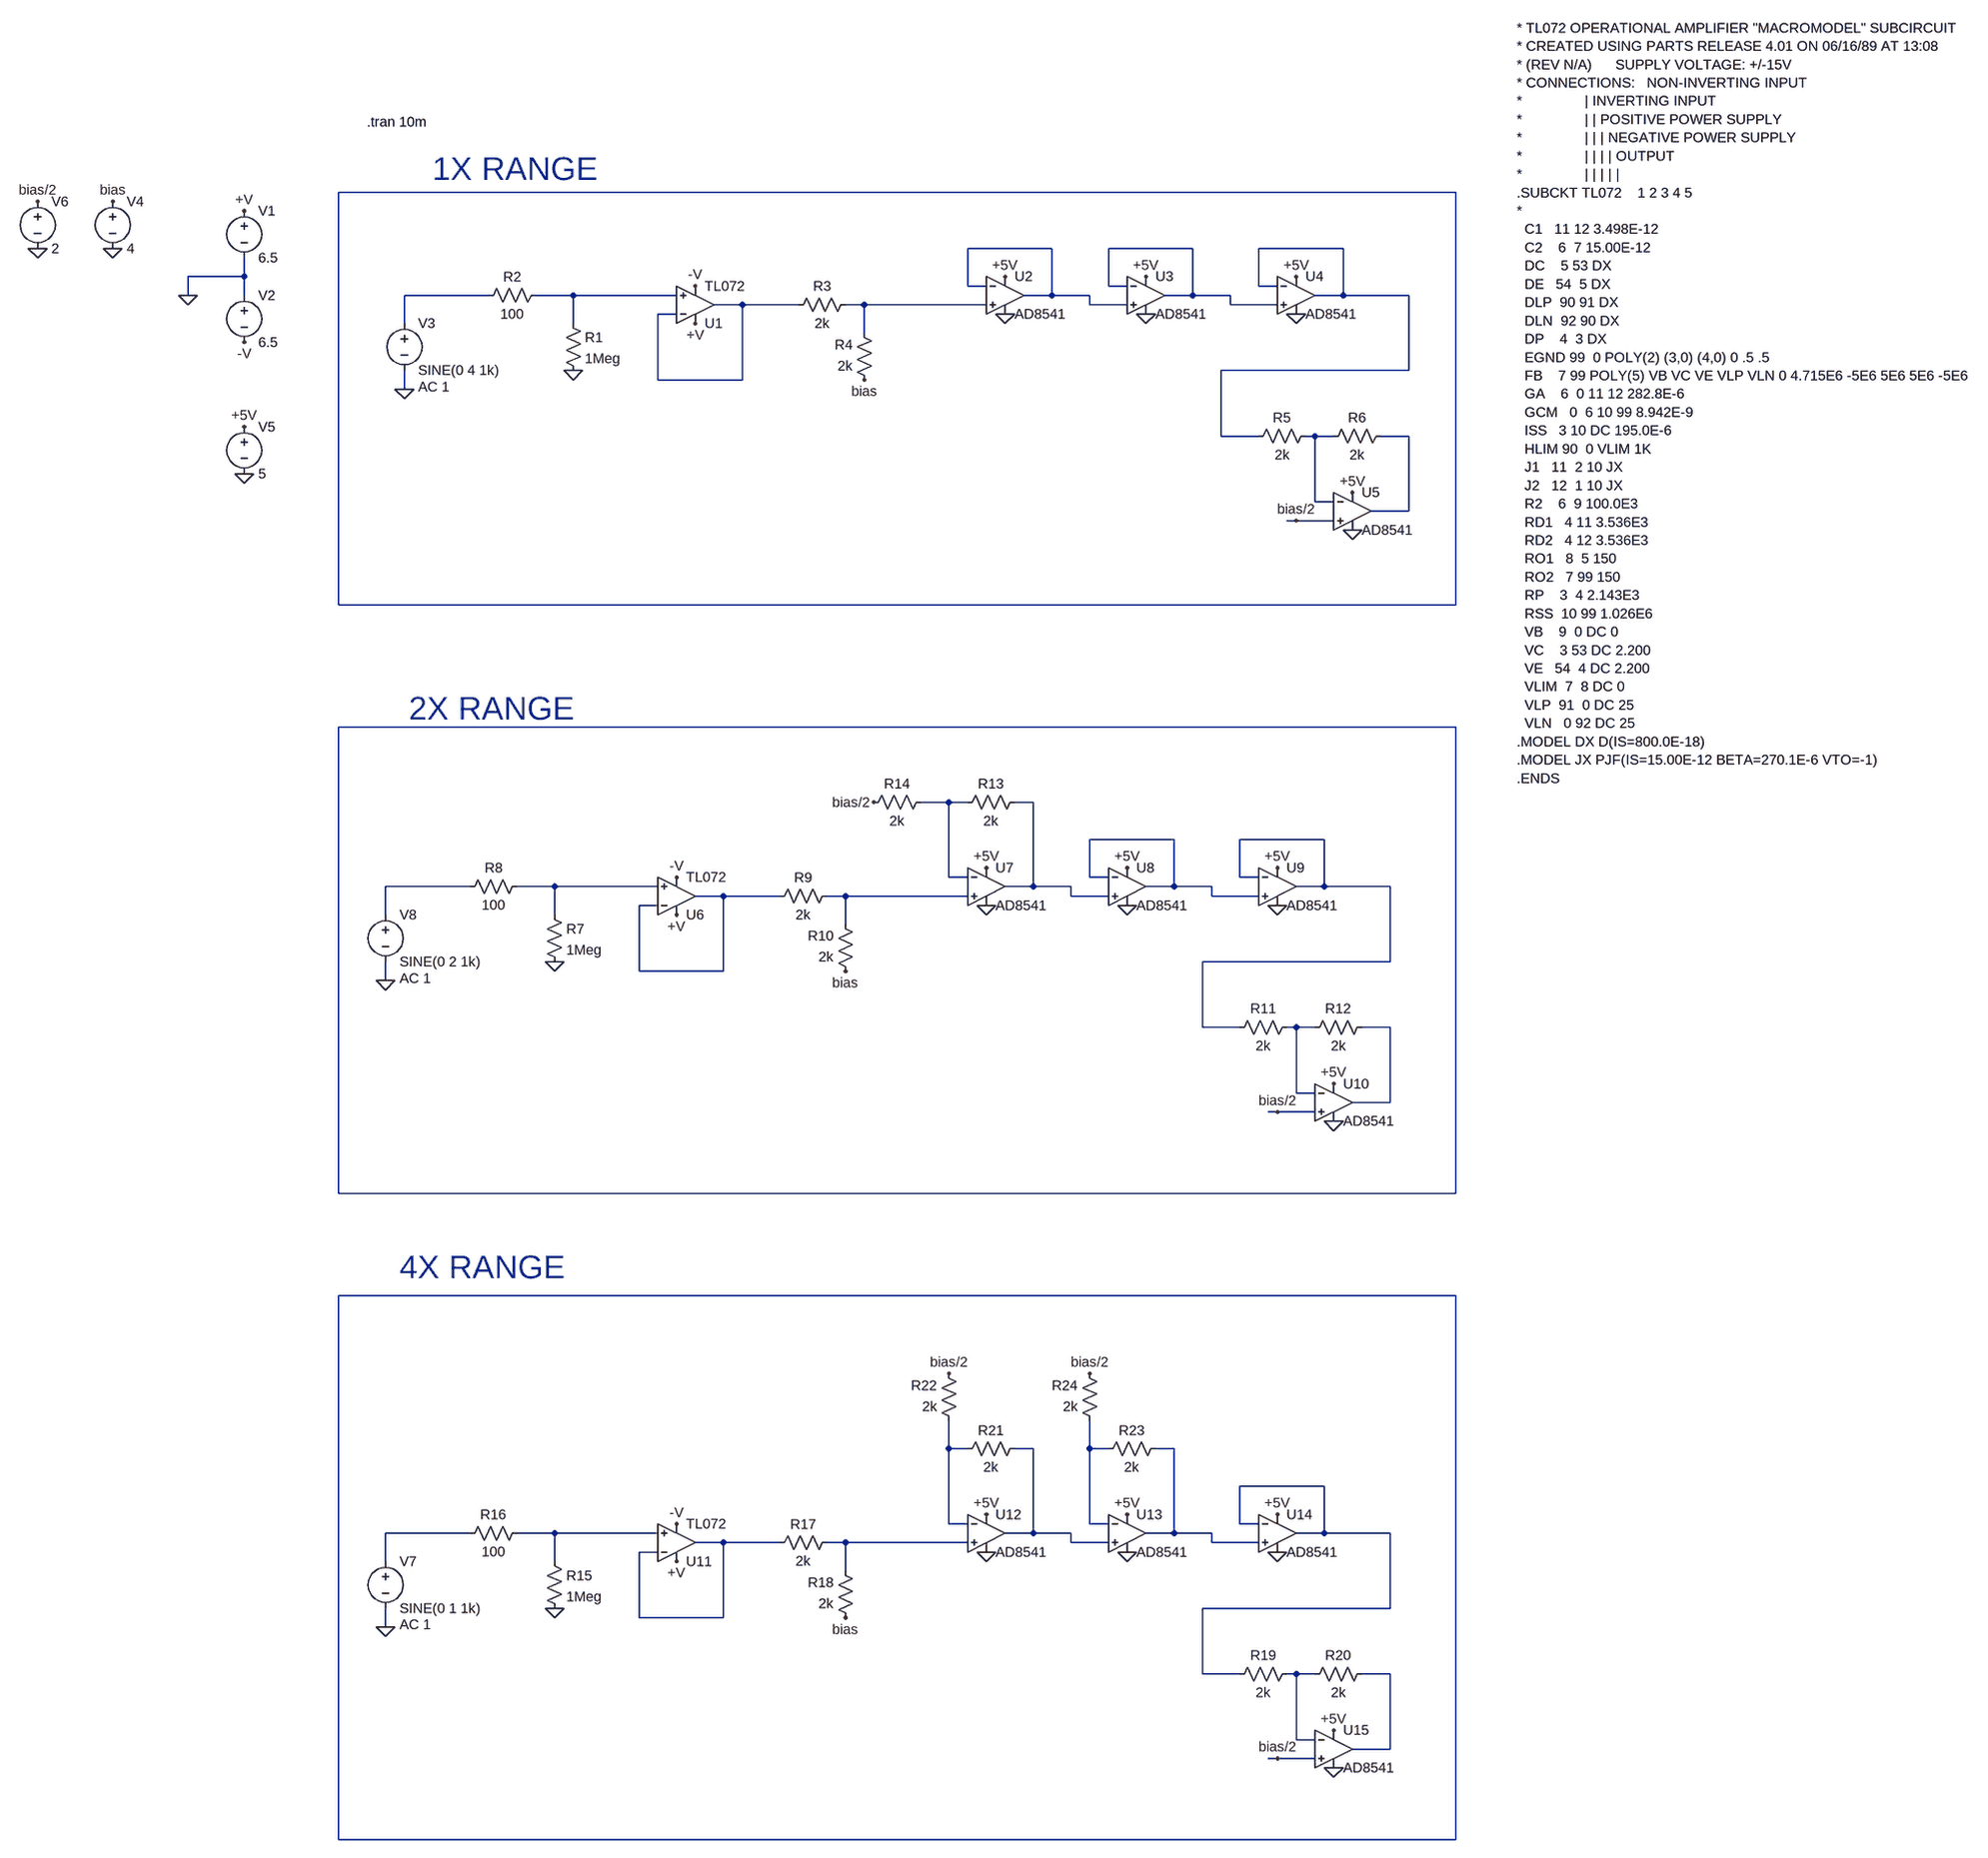
[diagram p0: schematic Analog_inputs.asc]
Analog_inputs.asc, the LTspice schematic file:
Version 4
SHEET 1 3056 3076
WIRE 1680 80 -224 80
WIRE 992 176 848 176
WIRE 1232 176 1088 176
WIRE 1488 176 1344 176
WIRE -480 224 -480 192
WIRE -480 224 -576 224
WIRE 848 240 848 176
WIRE 880 240 848 240
WIRE 1088 240 1088 176
WIRE 1120 240 1088 240
WIRE 1344 240 1344 176
WIRE 1376 240 1344 240
WIRE -576 256 -576 224
WIRE -480 256 -480 224
WIRE 32 256 -112 256
WIRE 176 256 112 256
WIRE 352 256 176 256
WIRE 992 256 992 176
WIRE 992 256 944 256
WIRE 1056 256 992 256
WIRE 1232 256 1232 176
WIRE 1232 256 1184 256
WIRE 1296 256 1232 256
WIRE 1488 256 1488 176
WIRE 1488 256 1440 256
WIRE 1600 256 1488 256
WIRE 464 272 416 272
WIRE 560 272 464 272
WIRE 672 272 640 272
WIRE 880 272 672 272
WIRE 1056 272 1056 256
WIRE 1120 272 1056 272
WIRE 1296 272 1296 256
WIRE 1376 272 1296 272
WIRE 352 288 320 288
WIRE -112 304 -112 256
WIRE 176 304 176 256
WIRE 672 320 672 272
WIRE 1600 384 1600 256
WIRE 1600 384 1280 384
WIRE 320 400 320 288
WIRE 464 400 464 272
WIRE 464 400 320 400
WIRE -112 416 -112 384
WIRE 1280 496 1280 384
WIRE 1344 496 1280 496
WIRE 1440 496 1424 496
WIRE 1472 496 1440 496
WIRE 1600 496 1552 496
WIRE 1440 608 1440 496
WIRE 1472 608 1440 608
WIRE 1600 624 1600 496
WIRE 1600 624 1536 624
WIRE 1408 640 1392 640
WIRE 1472 640 1408 640
WIRE -224 784 -224 80
WIRE 1680 784 1680 80
WIRE 1680 784 -224 784
WIRE 1680 992 -224 992
WIRE 816 1120 768 1120
WIRE 848 1120 816 1120
WIRE 960 1120 928 1120
WIRE 1200 1184 1056 1184
WIRE 1456 1184 1312 1184
WIRE 816 1248 816 1120
WIRE 848 1248 816 1248
WIRE 1056 1248 1056 1184
WIRE 1088 1248 1056 1248
WIRE 1312 1248 1312 1184
WIRE 1344 1248 1312 1248
WIRE 0 1264 -144 1264
WIRE 144 1264 80 1264
WIRE 320 1264 144 1264
WIRE 960 1264 960 1120
WIRE 960 1264 912 1264
WIRE 1024 1264 960 1264
WIRE 1200 1264 1200 1184
WIRE 1200 1264 1152 1264
WIRE 1264 1264 1200 1264
WIRE 1456 1264 1456 1184
WIRE 1456 1264 1408 1264
WIRE 1568 1264 1456 1264
WIRE 432 1280 384 1280
WIRE 528 1280 432 1280
WIRE 640 1280 608 1280
WIRE 848 1280 640 1280
WIRE 1024 1280 1024 1264
WIRE 1088 1280 1024 1280
WIRE 1264 1280 1264 1264
WIRE 1344 1280 1264 1280
WIRE 320 1296 288 1296
WIRE -144 1312 -144 1264
WIRE 144 1312 144 1264
WIRE 640 1328 640 1280
WIRE 1568 1392 1568 1264
WIRE 1568 1392 1248 1392
WIRE 288 1408 288 1296
WIRE 432 1408 432 1280
WIRE 432 1408 288 1408
WIRE -144 1424 -144 1392
WIRE 1248 1504 1248 1392
WIRE 1312 1504 1248 1504
WIRE 1408 1504 1392 1504
WIRE 1440 1504 1408 1504
WIRE 1568 1504 1520 1504
WIRE 1408 1616 1408 1504
WIRE 1440 1616 1408 1616
WIRE 1568 1632 1568 1504
WIRE 1568 1632 1504 1632
WIRE 1376 1648 1360 1648
WIRE 1440 1648 1376 1648
WIRE -224 1792 -224 992
WIRE 1680 1792 1680 992
WIRE 1680 1792 -224 1792
WIRE 1680 2096 -224 2096
WIRE 816 2384 816 2336
WIRE 848 2384 816 2384
WIRE 960 2384 928 2384
WIRE 1056 2384 1056 2336
WIRE 1088 2384 1056 2384
WIRE 1200 2384 1168 2384
WIRE 1456 2448 1312 2448
WIRE 816 2512 816 2384
WIRE 848 2512 816 2512
WIRE 1056 2512 1056 2384
WIRE 1088 2512 1056 2512
WIRE 1312 2512 1312 2448
WIRE 1344 2512 1312 2512
WIRE 0 2528 -144 2528
WIRE 144 2528 80 2528
WIRE 320 2528 144 2528
WIRE 960 2528 960 2384
WIRE 960 2528 912 2528
WIRE 1024 2528 960 2528
WIRE 1200 2528 1200 2384
WIRE 1200 2528 1152 2528
WIRE 1264 2528 1200 2528
WIRE 1456 2528 1456 2448
WIRE 1456 2528 1408 2528
WIRE 1568 2528 1456 2528
WIRE 432 2544 384 2544
WIRE 528 2544 432 2544
WIRE 640 2544 608 2544
WIRE 848 2544 640 2544
WIRE 1024 2544 1024 2528
WIRE 1088 2544 1024 2544
WIRE 1264 2544 1264 2528
WIRE 1344 2544 1264 2544
WIRE 320 2560 288 2560
WIRE -144 2576 -144 2528
WIRE 144 2576 144 2528
WIRE 640 2592 640 2544
WIRE 1568 2656 1568 2528
WIRE 1568 2656 1248 2656
WIRE 288 2672 288 2560
WIRE 432 2672 432 2544
WIRE 432 2672 288 2672
WIRE -144 2688 -144 2656
WIRE 1248 2768 1248 2656
WIRE 1312 2768 1248 2768
WIRE 1408 2768 1392 2768
WIRE 1440 2768 1408 2768
WIRE 1568 2768 1520 2768
WIRE 1408 2880 1408 2768
WIRE 1440 2880 1408 2880
WIRE 1568 2896 1568 2768
WIRE 1568 2896 1504 2896
WIRE 1376 2912 1360 2912
WIRE 1440 2912 1376 2912
WIRE -224 3072 -224 2096
WIRE 1680 3072 1680 2096
WIRE 1680 3072 -224 3072
FLAG -576 256 0
FLAG -480 112 +V
FLAG -480 336 -V
FLAG 384 304 +V
FLAG 384 240 -V
FLAG -112 416 0
FLAG 176 384 0
FLAG -704 96 bias
FLAG -704 176 0
FLAG 672 400 bias
FLAG 912 288 0
FLAG 1152 288 0
FLAG -480 480 +5V
FLAG -480 560 0
FLAG 912 224 +5V
FLAG 1152 224 +5V
FLAG 1408 288 0
FLAG 1408 224 +5V
FLAG 1504 656 0
FLAG 1504 592 +5V
FLAG -832 96 bias/2
FLAG -832 176 0
FLAG 1408 640 bias/2
FLAG 352 1312 +V
FLAG 352 1248 -V
FLAG -144 1424 0
FLAG 144 1392 0
FLAG 640 1408 bias
FLAG 880 1296 0
FLAG 1120 1296 0
FLAG 880 1232 +5V
FLAG 1120 1232 +5V
FLAG 1376 1296 0
FLAG 1376 1232 +5V
FLAG 1472 1664 0
FLAG 1472 1600 +5V
FLAG 1376 1648 bias/2
FLAG 688 1120 bias/2
FLAG 352 2576 +V
FLAG 352 2512 -V
FLAG -144 2688 0
FLAG 144 2656 0
FLAG 640 2672 bias
FLAG 880 2560 0
FLAG 1120 2560 0
FLAG 880 2496 +5V
FLAG 1120 2496 +5V
FLAG 1376 2560 0
FLAG 1376 2496 +5V
FLAG 1472 2928 0
FLAG 1472 2864 +5V
FLAG 1376 2912 bias/2
FLAG 816 2256 bias/2
FLAG 1056 2256 bias/2
SYMBOL voltage -480 96 R0
WINDOW 123 0 0 Left 0
WINDOW 39 0 0 Left 0
SYMATTR InstName V1
SYMATTR Value 6.5
SYMBOL voltage -480 240 R0
WINDOW 123 0 0 Left 0
WINDOW 39 0 0 Left 0
SYMATTR InstName V2
SYMATTR Value 6.5
SYMBOL voltage -112 288 R0
WINDOW 123 24 124 Left 2
WINDOW 39 0 0 Left 0
SYMATTR Value2 AC 1
SYMATTR InstName V3
SYMATTR Value SINE(0 4 1k)
SYMBOL res 160 288 R0
SYMATTR InstName R1
SYMATTR Value 1Meg
SYMBOL res 128 240 R90
WINDOW 0 0 56 VBottom 2
WINDOW 3 32 56 VTop 2
SYMATTR InstName R2
SYMATTR Value 100
SYMBOL res 656 256 R90
WINDOW 0 0 56 VBottom 2
WINDOW 3 32 56 VTop 2
SYMATTR InstName R3
SYMATTR Value 2k
SYMBOL res 688 416 R180
WINDOW 0 36 76 Left 2
WINDOW 3 36 40 Left 2
SYMATTR InstName R4
SYMATTR Value 2k
SYMBOL voltage -704 80 R0
WINDOW 123 0 0 Left 0
WINDOW 39 0 0 Left 0
SYMATTR InstName V4
SYMATTR Value 4
SYMBOL voltage -480 464 R0
WINDOW 123 0 0 Left 0
WINDOW 39 0 0 Left 0
SYMATTR InstName V5
SYMATTR Value 5
SYMBOL res 1328 512 R270
WINDOW 0 32 56 VTop 2
WINDOW 3 0 56 VBottom 2
SYMATTR InstName R5
SYMATTR Value 2k
SYMBOL res 1456 512 R270
WINDOW 0 32 56 VTop 2
WINDOW 3 0 56 VBottom 2
SYMATTR InstName R6
SYMATTR Value 2k
SYMBOL OpAmps\\opamp2 384 336 M180
SYMATTR InstName U1
SYMATTR Value TL072
SYMBOL OpAmps\\AD8541 912 192 R0
SYMATTR InstName U2
SYMBOL OpAmps\\AD8541 1152 192 R0
SYMATTR InstName U3
SYMBOL OpAmps\\AD8541 1408 192 R0
SYMATTR InstName U4
SYMBOL OpAmps\\AD8541 1504 560 R0
SYMATTR InstName U5
SYMBOL voltage -832 80 R0
WINDOW 123 0 0 Left 0
WINDOW 39 0 0 Left 0
SYMATTR InstName V6
SYMATTR Value 2
SYMBOL res 128 1296 R0
SYMATTR InstName R7
SYMATTR Value 1Meg
SYMBOL res 96 1248 R90
WINDOW 0 0 56 VBottom 2
WINDOW 3 32 56 VTop 2
SYMATTR InstName R8
SYMATTR Value 100
SYMBOL res 624 1264 R90
WINDOW 0 0 56 VBottom 2
WINDOW 3 32 56 VTop 2
SYMATTR InstName R9
SYMATTR Value 2k
SYMBOL res 656 1424 R180
WINDOW 0 36 76 Left 2
WINDOW 3 36 40 Left 2
SYMATTR InstName R10
SYMATTR Value 2k
SYMBOL res 1296 1520 R270
WINDOW 0 32 56 VTop 2
WINDOW 3 0 56 VBottom 2
SYMATTR InstName R11
SYMATTR Value 2k
SYMBOL res 1424 1520 R270
WINDOW 0 32 56 VTop 2
WINDOW 3 0 56 VBottom 2
SYMATTR InstName R12
SYMATTR Value 2k
SYMBOL OpAmps\\opamp2 352 1344 M180
SYMATTR InstName U6
SYMATTR Value TL072
SYMBOL OpAmps\\AD8541 880 1200 R0
SYMATTR InstName U7
SYMBOL OpAmps\\AD8541 1120 1200 R0
SYMATTR InstName U8
SYMBOL OpAmps\\AD8541 1376 1200 R0
SYMATTR InstName U9
SYMBOL OpAmps\\AD8541 1472 1568 R0
SYMATTR InstName U10
SYMBOL voltage -144 1296 R0
WINDOW 123 24 124 Left 2
WINDOW 39 0 0 Left 0
SYMATTR Value2 AC 1
SYMATTR InstName V8
SYMATTR Value SINE(0 2 1k)
SYMBOL res 944 1104 R90
WINDOW 0 0 56 VBottom 2
WINDOW 3 32 56 VTop 2
SYMATTR InstName R13
SYMATTR Value 2k
SYMBOL res 784 1104 R90
WINDOW 0 0 56 VBottom 2
WINDOW 3 32 56 VTop 2
SYMATTR InstName R14
SYMATTR Value 2k
SYMBOL res 128 2560 R0
SYMATTR InstName R15
SYMATTR Value 1Meg
SYMBOL res 96 2512 R90
WINDOW 0 0 56 VBottom 2
WINDOW 3 32 56 VTop 2
SYMATTR InstName R16
SYMATTR Value 100
SYMBOL res 624 2528 R90
WINDOW 0 0 56 VBottom 2
WINDOW 3 32 56 VTop 2
SYMATTR InstName R17
SYMATTR Value 2k
SYMBOL res 656 2688 R180
WINDOW 0 36 76 Left 2
WINDOW 3 36 40 Left 2
SYMATTR InstName R18
SYMATTR Value 2k
SYMBOL res 1296 2784 R270
WINDOW 0 32 56 VTop 2
WINDOW 3 0 56 VBottom 2
SYMATTR InstName R19
SYMATTR Value 2k
SYMBOL res 1424 2784 R270
WINDOW 0 32 56 VTop 2
WINDOW 3 0 56 VBottom 2
SYMATTR InstName R20
SYMATTR Value 2k
SYMBOL OpAmps\\opamp2 352 2608 M180
SYMATTR InstName U11
SYMATTR Value TL072
SYMBOL OpAmps\\AD8541 880 2464 R0
SYMATTR InstName U12
SYMBOL OpAmps\\AD8541 1120 2464 R0
SYMATTR InstName U13
SYMBOL OpAmps\\AD8541 1376 2464 R0
SYMATTR InstName U14
SYMBOL OpAmps\\AD8541 1472 2832 R0
SYMATTR InstName U15
SYMBOL voltage -144 2560 R0
WINDOW 123 24 124 Left 2
WINDOW 39 0 0 Left 0
SYMATTR Value2 AC 1
SYMATTR InstName V7
SYMATTR Value SINE(0 1 1k)
SYMBOL res 944 2368 R90
WINDOW 0 0 56 VBottom 2
WINDOW 3 32 56 VTop 2
SYMATTR InstName R21
SYMATTR Value 2k
SYMBOL res 832 2352 R180
WINDOW 0 36 76 Left 2
WINDOW 3 36 40 Left 2
SYMATTR InstName R22
SYMATTR Value 2k
SYMBOL res 1184 2368 R90
WINDOW 0 0 56 VBottom 2
WINDOW 3 32 56 VTop 2
SYMATTR InstName R23
SYMATTR Value 2k
SYMBOL res 1072 2352 R180
WINDOW 0 36 76 Left 2
WINDOW 3 36 40 Left 2
SYMATTR InstName R24
SYMATTR Value 2k
TEXT -176 -40 Left 2 !.tran 10m
TEXT 1824 -200 Left 2 !* TL072 OPERATIONAL AMPLIFIER "MACROMODEL" SUBCIRCUIT\n* CREATED USING PARTS RELEASE 4.01 ON 06/16/89 AT 13:08\n* (REV N/A)      SUPPLY VOLTAGE: +/-15V\n* CONNECTIONS:   NON-INVERTING INPUT\n*                | INVERTING INPUT\n*                | | POSITIVE POWER SUPPLY\n*                | | | NEGATIVE POWER SUPPLY\n*                | | | | OUTPUT\n*                | | | | |\n.SUBCKT TL072    1 2 3 4 5\n*\n  C1   11 12 3.498E-12\n  C2    6  7 15.00E-12\n  DC    5 53 DX\n  DE   54  5 DX\n  DLP  90 91 DX\n  DLN  92 90 DX\n  DP    4  3 DX\n  EGND 99  0 POLY(2) (3,0) (4,0) 0 .5 .5\n  FB    7 99 POLY(5) VB VC VE VLP VLN 0 4.715E6 -5E6 5E6 5E6 -5E6\n  GA    6  0 11 12 282.8E-6\n  GCM   0  6 10 99 8.942E-9\n  ISS   3 10 DC 195.0E-6\n  HLIM 90  0 VLIM 1K\n  J1   11  2 10 JX\n  J2   12  1 10 JX\n  R2    6  9 100.0E3\n  RD1   4 11 3.536E3\n  RD2   4 12 3.536E3\n  RO1   8  5 150\n  RO2   7 99 150\n  RP    3  4 2.143E3\n  RSS  10 99 1.026E6\n  VB    9  0 DC 0\n  VC    3 53 DC 2.200\n  VE   54  4 DC 2.200\n  VLIM  7  8 DC 0\n  VLP  91  0 DC 25\n  VLN   0 92 DC 25\n.MODEL DX D(IS=800.0E-18)\n.MODEL JX PJF(IS=15.00E-12 BETA=270.1E-6 VTO=-1)\n.ENDS
TEXT -64 40 Left 5 ;1X RANGE
TEXT -104 960 Left 5 ;2X RANGE
TEXT -120 2048 Left 5 ;4X RANGE

The netlist it stands for:
* Analog_inputs.asc
V1 +V 0 6.5
V2 0 -V 6.5
V3 N005 0 SINE(0 4 1k) AC 1
R1 N006 0 1Meg
R2 N006 N005 100
R3 N008 N007 2k
R4 bias N008 2k
V4 bias 0 4
V5 +5V 0 5
R5 N004 N009 2k
R6 N009 N010 2k
XU1 N006 N007 +V -V N007 TL072  ; pins In+ In- V+ V- OUT
XU2 N008 N002 +5V 0 N002 AD8541  ; pins In+ In- V+ V- OUT
XU3 N002 N003 +5V 0 N003 AD8541  ; pins In+ In- V+ V- OUT
XU4 N003 N004 +5V 0 N004 AD8541  ; pins In+ In- V+ V- OUT
XU5 bias/2 N009 +5V 0 N010 AD8541  ; pins In+ In- V+ V- OUT
V6 bias/2 0 2
R7 N017 0 1Meg
R8 N017 N016 100
R9 N019 N018 2k
R10 bias N019 2k
R11 N015 N020 2k
R12 N020 N021 2k
XU6 N017 N018 +V -V N018 TL072  ; pins In+ In- V+ V- OUT
XU7 N019 N012 +5V 0 N013 AD8541  ; pins In+ In- V+ V- OUT
XU8 N013 N014 +5V 0 N014 AD8541  ; pins In+ In- V+ V- OUT
XU9 N014 N015 +5V 0 N015 AD8541  ; pins In+ In- V+ V- OUT
XU10 bias/2 N020 +5V 0 N021 AD8541  ; pins In+ In- V+ V- OUT
V8 N016 0 SINE(0 2 1k) AC 1
R13 N013 N012 2k
R14 N012 bias/2 2k
R15 N029 0 1Meg
R16 N029 N028 100
R17 N031 N030 2k
R18 bias N031 2k
R19 N027 N032 2k
R20 N032 N033 2k
XU11 N029 N030 +V -V N030 TL072  ; pins In+ In- V+ V- OUT
XU12 N031 N023 +5V 0 N024 AD8541  ; pins In+ In- V+ V- OUT
XU13 N024 N025 +5V 0 N026 AD8541  ; pins In+ In- V+ V- OUT
XU14 N026 N027 +5V 0 N027 AD8541  ; pins In+ In- V+ V- OUT
XU15 bias/2 N032 +5V 0 N033 AD8541  ; pins In+ In- V+ V- OUT
V7 N028 0 SINE(0 1 1k) AC 1
R21 N024 N023 2k
R22 N023 bias/2 2k
R23 N026 N025 2k
R24 N025 bias/2 2k
.tran 10m
* TL072 OPERATIONAL AMPLIFIER "MACROMODEL" SUBCIRCUIT
* CREATED USING PARTS RELEASE 4.01 ON 06/16/89 AT 13:08
* (REV N/A)      SUPPLY VOLTAGE: +/-15V
* CONNECTIONS:   NON-INVERTING INPUT
*                | INVERTING INPUT
*                | | POSITIVE POWER SUPPLY
*                | | | NEGATIVE POWER SUPPLY
*                | | | | OUTPUT
*                | | | | |
.SUBCKT TL072    1 2 3 4 5
*
  C1   11 12 3.498E-12
  C2    6  7 15.00E-12
  DC    5 53 DX
  DE   54  5 DX
  DLP  90 91 DX
  DLN  92 90 DX
  DP    4  3 DX
  EGND 99  0 POLY(2) (3,0) (4,0) 0 .5 .5
  FB    7 99 POLY(5) VB VC VE VLP VLN 0 4.715E6 -5E6 5E6 5E6 -5E6
  GA    6  0 11 12 282.8E-6
  GCM   0  6 10 99 8.942E-9
  ISS   3 10 DC 195.0E-6
  HLIM 90  0 VLIM 1K
  J1   11  2 10 JX
  J2   12  1 10 JX
  R2    6  9 100.0E3
  RD1   4 11 3.536E3
  RD2   4 12 3.536E3
  RO1   8  5 150
  RO2   7 99 150
  RP    3  4 2.143E3
  RSS  10 99 1.026E6
  VB    9  0 DC 0
  VC    3 53 DC 2.200
  VE   54  4 DC 2.200
  VLIM  7  8 DC 0
  VLP  91  0 DC 25
  VLN   0 92 DC 25
.MODEL DX D(IS=800.0E-18)
.MODEL JX PJF(IS=15.00E-12 BETA=270.1E-6 VTO=-1)
.ENDS
* 1X RANGE
* 2X RANGE
* 4X RANGE
.backanno
.end